# EAGLE design projeto_jcarlos(compacta) (EAGLE 6.2)
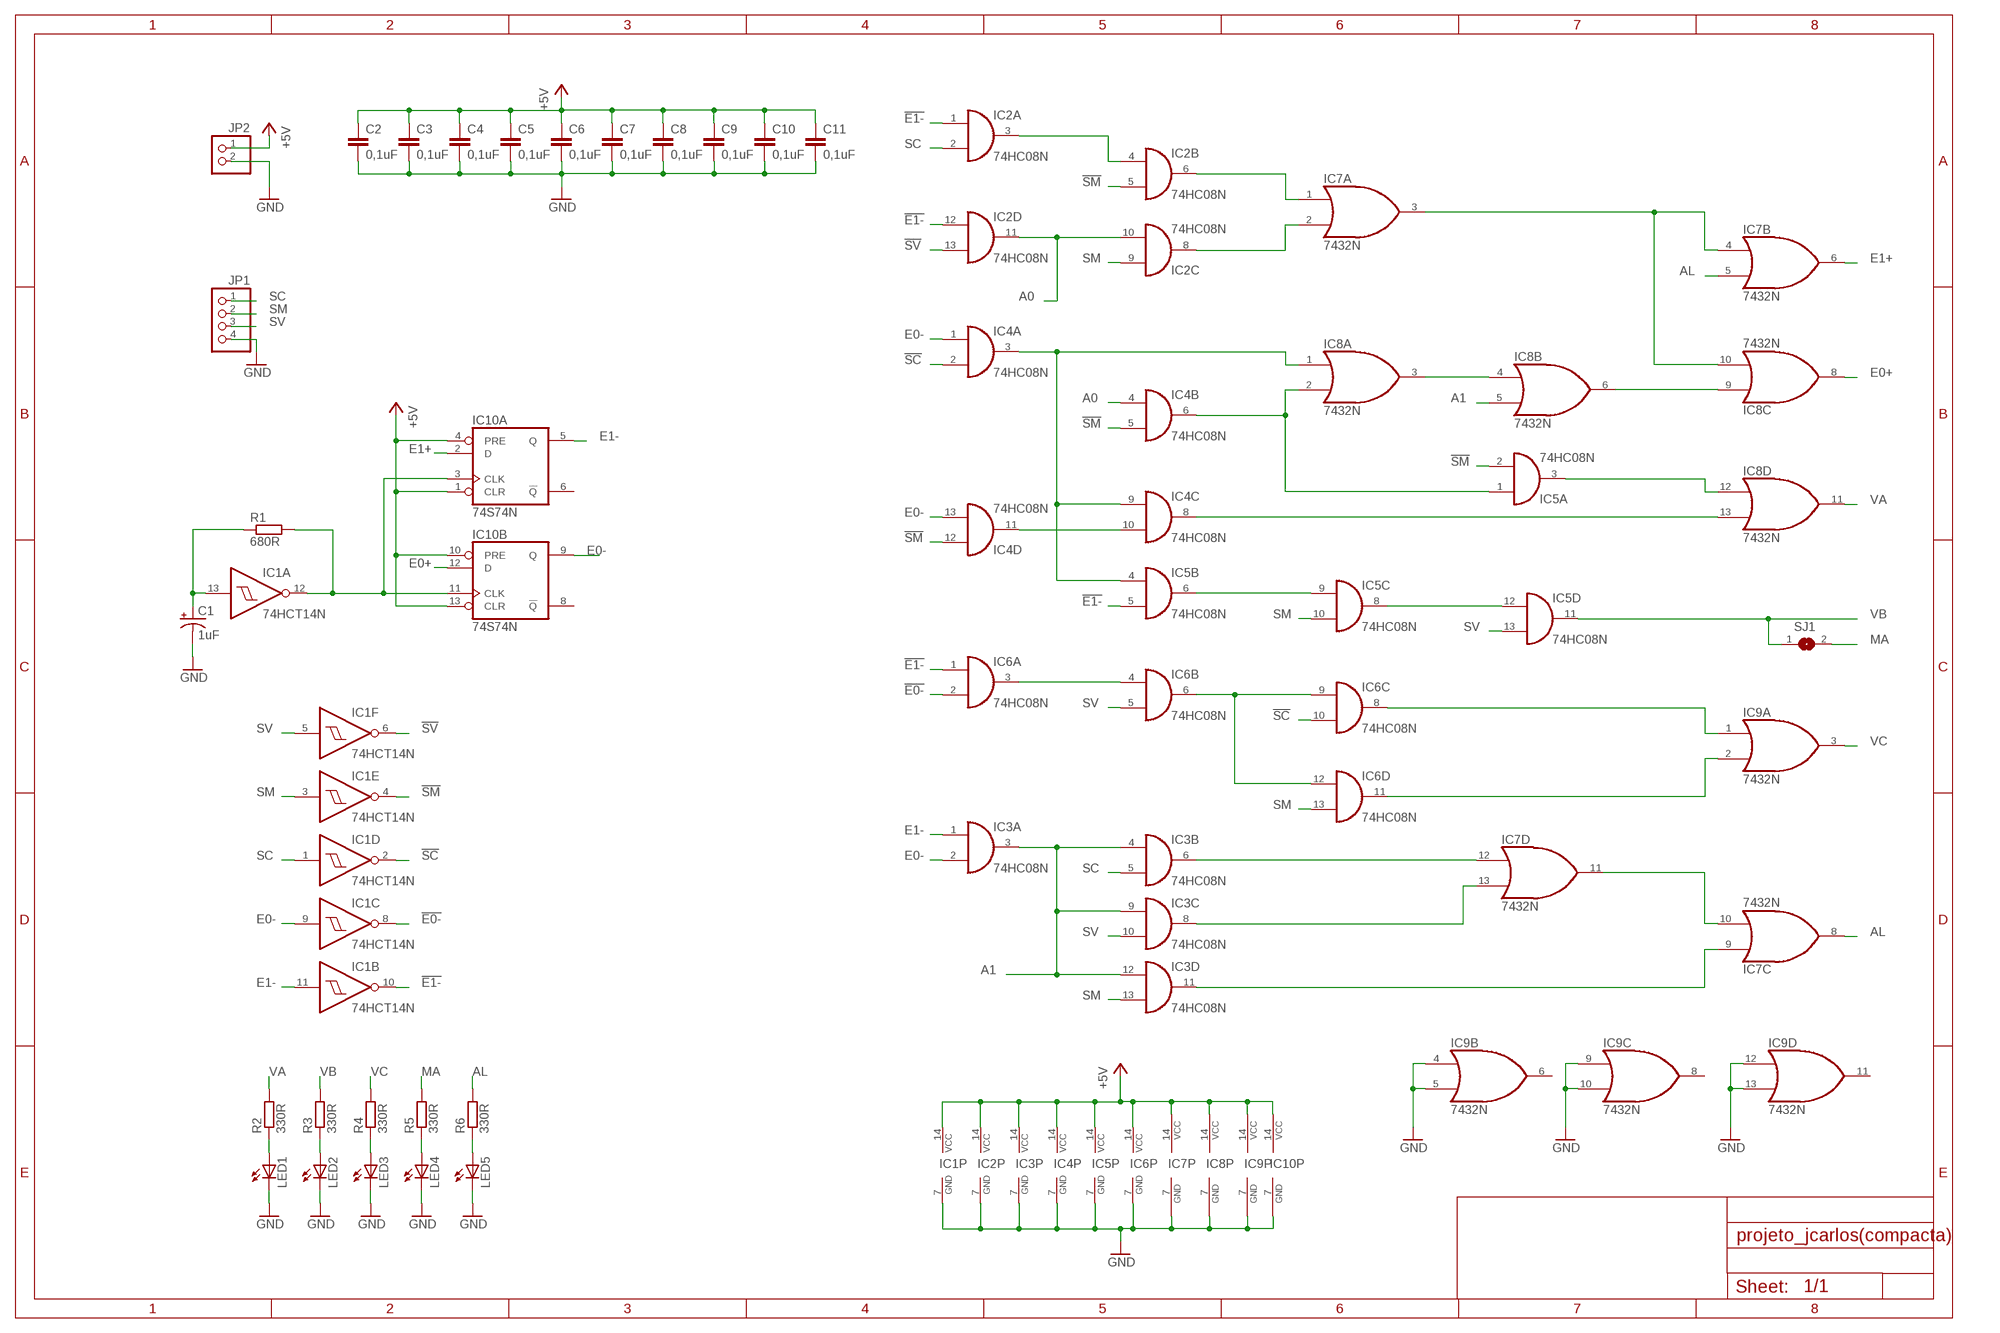
[diagram p0: schematic, sheet 1]

## Parts
C1  1uF  CPOL-USE5-6  [E5-6]
C2  0,1uF  C-EU025-025X050  [C025-025X050]
C3  0,1uF  C-EU025-025X050  [C025-025X050]
C4  0,1uF  C-EU025-025X050  [C025-025X050]
C5  0,1uF  C-EU025-025X050  [C025-025X050]
C6  0,1uF  C-EU025-025X050  [C025-025X050]
C7  0,1uF  C-EU025-025X050  [C025-025X050]
C8  0,1uF  C-EU025-025X050  [C025-025X050]
C9  0,1uF  C-EU025-025X050  [C025-025X050]
C10  0,1uF  C-EU025-025X050  [C025-025X050]
C11  0,1uF  C-EU025-025X050  [C025-025X050]
IC1  74HCT14N  [DIL14]
IC2  74HC08N  [DIL14]
IC3  74HC08N  [DIL14]
IC4  74HC08N  [DIL14]
IC5  74HC08N  [DIL14]
IC6  74HC08N  [DIL14]
IC7  7432N  [DIL14]
IC8  7432N  [DIL14]
IC9  7432N  [DIL14]
IC10  74S74N  [DIL14]
JP1  PINHD-1X4  [1X04]
JP2  PINHD-1X2  [1X02]
LED1  LED5MM  [LED5MM]
LED2  LED5MM  [LED5MM]
LED3  LED5MM  [LED5MM]
LED4  LED5MM  [LED5MM]
LED5  LED5MM  [LED5MM]
R1  680R  R-EU_0204/5  [0204/5]
R2  330R  R-EU_0204/5  [0204/5]
R3  330R  R-EU_0204/5  [0204/5]
R4  330R  R-EU_0204/5  [0204/5]
R5  330R  R-EU_0204/5  [0204/5]
R6  330R  R-EU_0204/5  [0204/5]
SJ1  SJ  [SJ]

## Nets
!E0-: IC1.8(C:O) IC6.2(A:I1)
!E1-: IC1.10(B:O) IC2.1(A:I0) IC2.12(D:I0) IC5.5(B:I1) IC6.1(A:I0)
!SC: IC1.2(D:O) IC4.2(A:I1) IC6.10(C:I1)
!SM: IC1.4(E:O) IC2.5(B:I1) IC4.5(B:I1) IC4.12(D:I0) IC5.2(A:I1)
!SV: IC1.6(F:O) IC2.13(D:I1)
+5V: C2.1 C3.1 C4.1 C5.1 C6.1 C7.1 C8.1 C9.1 C10.1 C11.1 IC1.14(P:VCC) IC2.14(P:VCC) IC3.14(P:VCC) IC4.14(P:VCC) IC5.14(P:VCC) IC6.14(P:VCC) IC7.14(P:VCC) IC8.14(P:VCC) IC9.14(P:VCC) IC10.1(A:CLR) IC10.4(A:PRE) IC10.10(B:PRE) IC10.13(B:CLR) IC10.14(P:VCC) JP2.1
A0: IC2.10(C:I1) IC2.11(D:O) IC4.4(B:I0)
A1: IC3.3(A:O) IC3.4(B:I0) IC3.9(C:I0) IC3.12(D:I0) IC8.5(B:I1)
AL: IC7.5(B:I1) IC7.8(C:O) R6.2
E0+: IC8.8(C:O) IC10.12(B:D)
E0-: IC1.9(C:I) IC3.2(A:I1) IC4.1(A:I0) IC4.13(D:I1) IC10.9(B:Q)
E1+: IC7.6(B:O) IC10.2(A:D)
E1-: IC1.11(B:I) IC3.1(A:I0) IC10.5(A:Q)
GND: C1.- C2.2 C3.2 C4.2 C5.2 C6.2 C7.2 C8.2 C9.2 C10.2 C11.2 IC1.7(P:GND) IC2.7(P:GND) IC3.7(P:GND) IC4.7(P:GND) IC5.7(P:GND) IC6.7(P:GND) IC7.7(P:GND) IC8.7(P:GND) IC9.4(B:I0) IC9.5(B:I1) IC9.7(P:GND) IC9.9(C:I0) IC9.10(C:I1) IC9.12(D:I0) IC9.13(D:I1) IC10.7(P:GND) JP1.4 JP2.2 LED1.K(C) LED2.K(C) LED3.K(C) LED4.K(C) LED5.K(C)
MA: R5.2 SJ1.2
N$1: IC5.6(B:O) IC5.9(C:I0)
N$2: IC7.3(A:O) IC7.4(B:I0) IC8.10(C:I1)
N$3: IC4.10(C:I1) IC4.11(D:O)
N$4: IC4.8(C:O) IC8.13(D:I1)
N$5: IC8.3(A:O) IC8.4(B:I0)
N$6: IC5.3(A:O) IC8.12(D:I0)
N$7: C1.+ IC1.13(A:I) R1.1
N$8: IC1.12(A:O) IC10.3(A:CLK) IC10.11(B:CLK) R1.2
N$9: IC8.6(B:O) IC8.9(C:I0)
N$10: IC4.3(A:O) IC4.9(C:I0) IC5.4(B:I0) IC8.1(A:I0)
N$11: IC5.8(C:O) IC5.12(D:I0)
N$12: IC4.6(B:O) IC5.1(A:I0) IC8.2(A:I1)
N$13: IC2.3(A:O) IC2.4(B:I0)
N$14: LED1.A R2.1
N$15: IC2.6(B:O) IC7.1(A:I0)
N$16: LED2.A R3.1
N$17: LED3.A R4.1
N$18: IC2.8(C:O) IC7.2(A:I1)
N$19: IC3.6(B:O) IC7.12(D:I0)
N$20: IC3.8(C:O) IC7.13(D:I1)
N$21: IC3.11(D:O) IC7.9(C:I0)
N$22: IC7.10(C:I1) IC7.11(D:O)
N$23: LED4.A R5.1
N$24: LED5.A R6.1
N$27: IC6.3(A:O) IC6.4(B:I0)
N$29: IC6.6(B:O) IC6.9(C:I0) IC6.12(D:I0)
N$32: IC6.8(C:O) IC9.1(A:I0)
N$33: IC6.11(D:O) IC9.2(A:I1)
SC: IC1.1(D:I) IC2.2(A:I1) IC3.5(B:I1) JP1.1
SM: IC1.3(E:I) IC2.9(C:I0) IC3.13(D:I1) IC5.10(C:I1) IC6.13(D:I1) JP1.2
SV: IC1.5(F:I) IC3.10(C:I1) IC5.13(D:I1) IC6.5(B:I1) JP1.3
VA: IC8.11(D:O) R2.2
VB: IC5.11(D:O) R3.2 SJ1.1
VC: IC9.3(A:O) R4.2
Unconnected: IC9.6(B:O) IC9.8(C:O) IC9.11(D:O) IC10.6(A:!Q) IC10.8(B:!Q)

## Library data of the parts
C1 = rcl:CPOL-US: POLARIZED CAPACITOR, American symbol; E5-6: E5-6
C2-C11 = rcl:C-EU: CAPACITOR, European symbol
IC1 = 74xx-eu:74*14: Hex schmitt trigger INVERTER
IC2-IC6 = 74xx-eu:74*08: Quad 2-input AND gate
IC7-IC9 = 74xx-us:74*32: Quad 2-input OR gate
IC10 = 74xx-us:74*74: Dual D type positive edge triggered FLIP FLOP, preset and clear
JP1 = pinhead:PINHD-1X4: PIN HEADER
JP2 = pinhead:PINHD-1X2: PIN HEADER
LED1-LED5 = led:LED: LED OSRAM: - CHIPLED LG R971, LG N971, LY N971, LG Q971, LY Q971, LO R971, LY R971 LH N974, LH R974 LS Q976, LO Q976, LY Q976 LO Q996 - Hyper CHIPLED LW Q18S LB Q993, LB Q99A, LB R99A - SideLED LS A670, LO A670, LY A670, LG A670, LP A670 LB A673, LV A673, LT A673, LW A673 LH A674 LY A675 LS A676, LA A676, LO A676, LY A676, LW A676 LS A679, LY A679, LG A679 - Hyper Micro SIDELED® LS Y876, LA Y876, LO Y876, LY Y876 LT Y87S - SmartLED LW L88C, LW L88S LB L89C, LB L89S, LG L890 LS L89K, LO L89K, LY L89K LS L896, LA L896, LO L896, LY L896 - TOPLED LS T670, LO T670, LY T670, LG T670, LP T670 LSG T670, LSP T670, LSY T670, LOP T670, LYG T670 LG T671, LOG T671, LSG T671 LB T673, LV T673, LT T673, LW T673 LH T674 LS T676, LA T676, LO T676, LY T676, LB T676, LH T676, LSB T676, LW T676 LB T67C, LV T67C, LT T67C, LS T67K, LO T67K, LY T67K, LW E67C LS E67B, LA E67B, LO E67B, LY E67B, LB E67C, LV E67C, LT E67C LW T67C LS T679, LY T679, LG T679 LS T770, LO T770, LY T770, LG T770, LP T770 LB T773, LV T773, LT T773, LW T773 LH T774 LS E675, LA E675, LY E675, LS T675 LS T776, LA T776, LO T776, LY T776, LB T776 LHGB T686 LT T68C, LB T68C - Hyper Mini TOPLED® LB M676 - Mini TOPLED Santana® LG M470 LS M47K, LO M47K, LY M47K Source: http://www.osram.convergy.de LUXEON: - LUMILED® LXK2-PW12-R00, LXK2-PW12-S00, LXK2-PW14-U00, LXK2-PW14-V00 LXK2-PM12-R00, LXK2-PM12-S00, LXK2-PM14-U00 LXK2-PE12-Q00, LXK2-PE12-R00, LXK2-PE12-S00, LXK2-PE14-T00, LXK2-PE14-U00 LXK2-PB12-K00, LXK2-PB12-L00, LXK2-PB12-M00, LXK2-PB14-N00, LXK2-PB14-P00, LXK2-PB14-Q00 LXK2-PR12-L00, LXK2-PR12-M00, LXK2-PR14-Q00, LXK2-PR14-R00 LXK2-PD12-Q00, LXK2-PD12-R00, LXK2-PD12-S00 LXK2-PH12-R00, LXK2-PH12-S00 LXK2-PL12-P00, LXK2-PL12-Q00, LXK2-PL12-R00 Source: www.luxeon.com KINGBRIGHT: KA-3528ASYC Source: www.kingbright.com
R1-R6 = rcl:R-EU_: RESISTOR, European symbol
SJ1 = jumper:SJ: SMD solder JUMPER

## Board
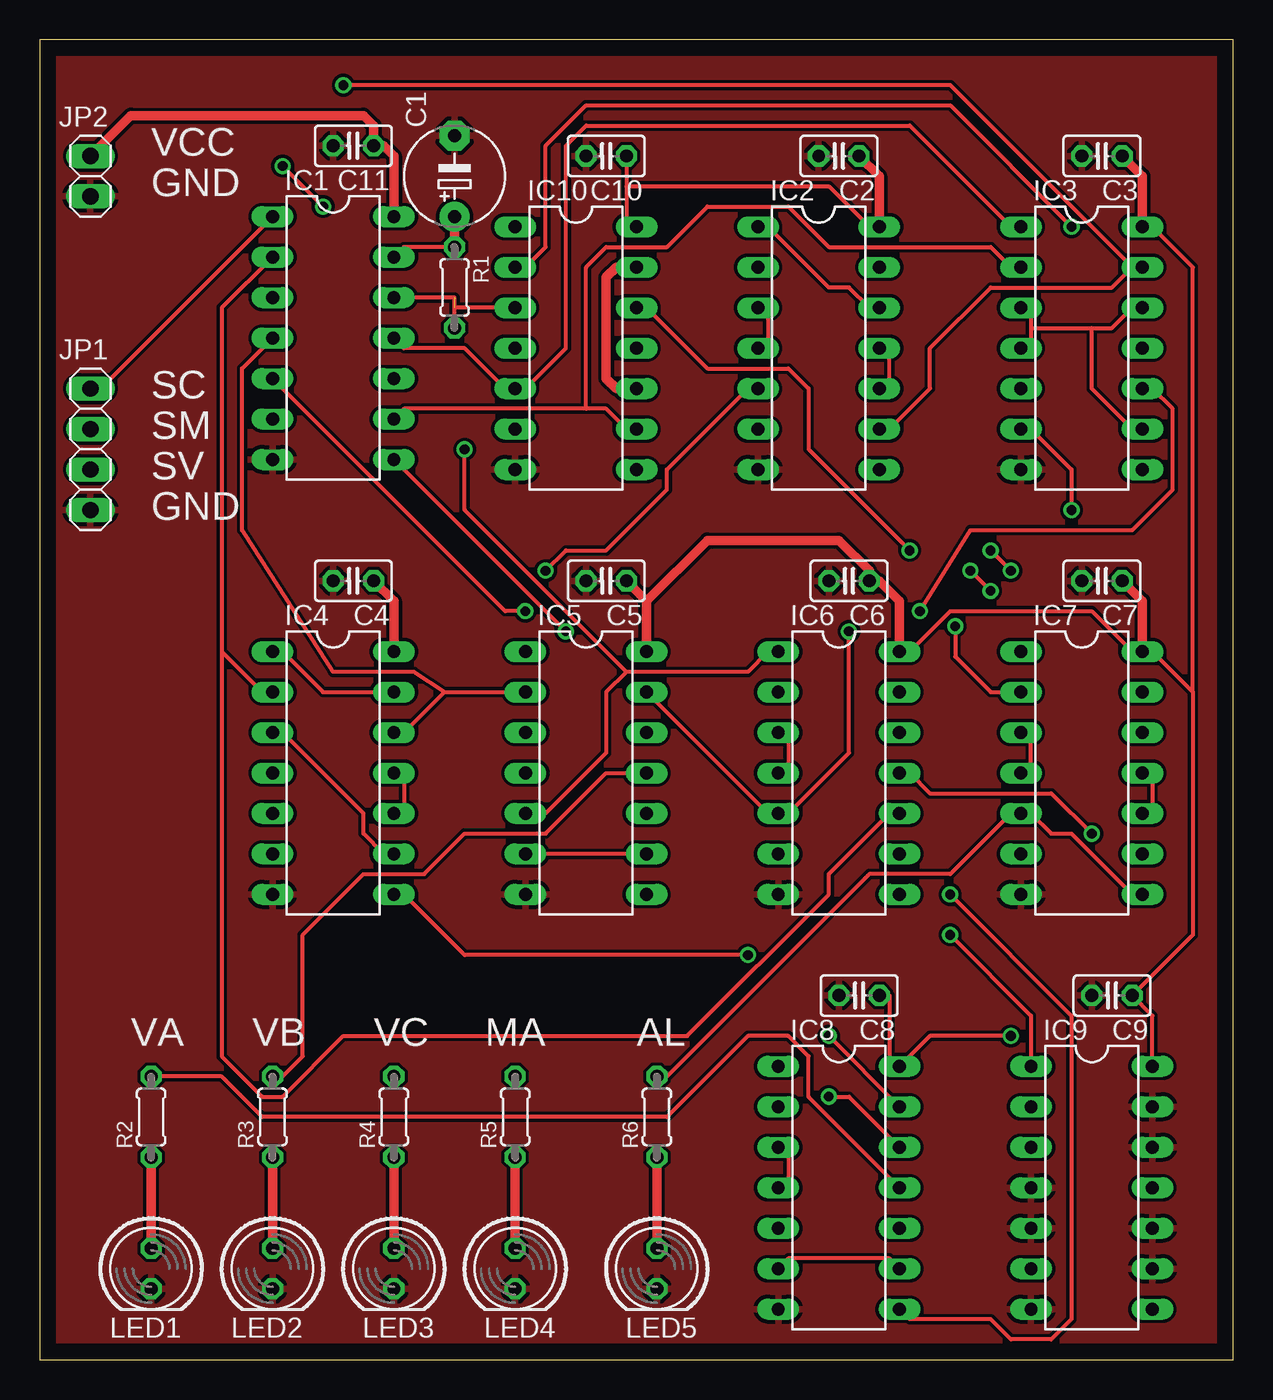
[diagram p1: board, top side]
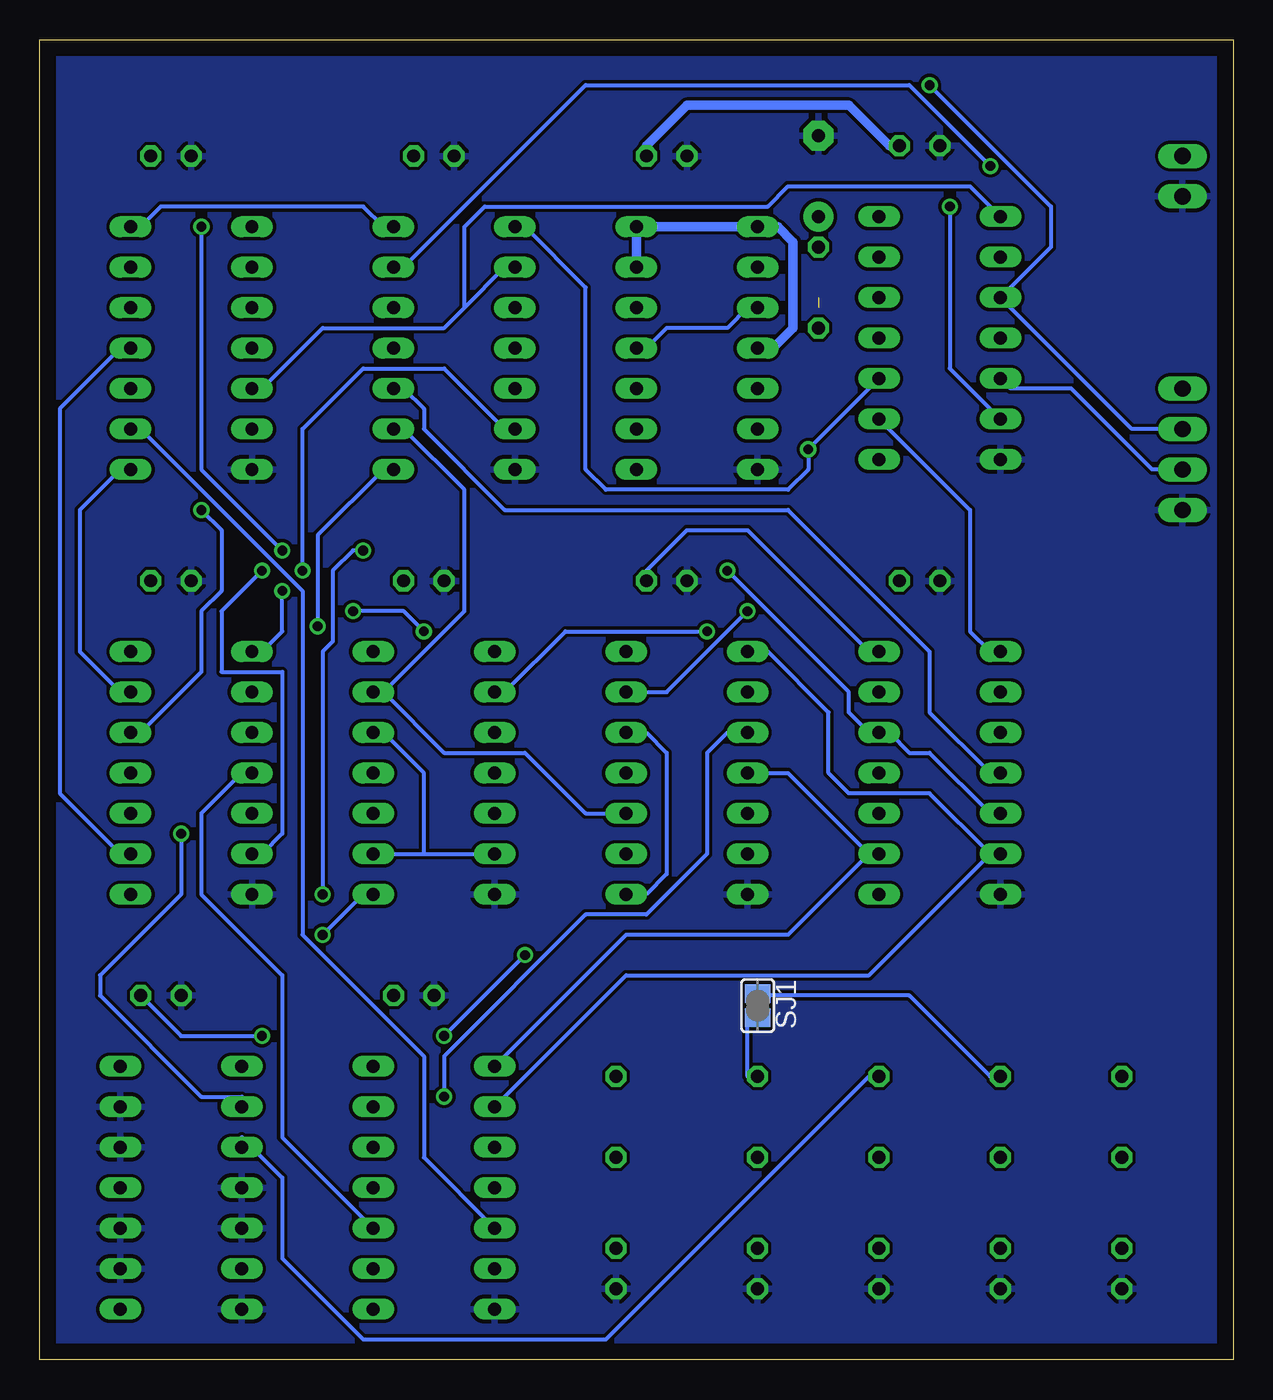
[diagram p2: board, bottom side, seen from below]

Size 74.91 x 82.86 mm. Coordinates in mm from the lower left corner, seen from the top.
Outline: 0,0 74.91,0 74.91,82.86 0,82.86 0,0
Copper layers (1*16): Top 0.035mm / dielectric 1.5mm / Bottom 0.035mm
Design rules: minimum track width 10mil, minimum drill 24mil, track to track 8mil, track to pad 8mil, pad to pad 8mil, via to via 8mil, smd to smd 8mil, copper to edge 40mil, drill to drill 8mil, minimum pad ring 10mil, minimum via ring 8mil, stop-mask expansion 4mil, vias tented up to drill 0mil, thermal gap 10mil

### Footprints (pad centres in the part's own frame; a part is rotated, then mirrored left to right if it is on the bottom)
E5-6 = drill 0.813 pad 1.905: + -2.54,0 | drill 0.813 pad 1.905 octagon: - 2.54,0
C025-025X050 = drill 0.813 octagon: 1 -1.27,0; 2 1.27,0
DIL14 = drill 0.813 long: 1 -7.62,-3.81; 2 -5.08,-3.81; 3 -2.54,-3.81; 4 0,-3.81; 5 2.54,-3.81; 6 5.08,-3.81; 7 7.62,-3.81; 8 7.62,3.81; 9 5.08,3.81; 10 2.54,3.81; 11 0,3.81; 12 -2.54,3.81; 13 -5.08,3.81; 14 -7.62,3.81
1X04 = drill 1.016 long: 1 -3.81,0; 2 -1.27,0; 3 1.27,0; 4 3.81,0
1X02 = drill 1.016 long: 1 -1.27,0; 2 1.27,0
LED5MM = drill 0.813 octagon: A -1.27,0; K 1.27,0
0204/5 = drill 0.813 octagon: 1 -2.54,0; 2 2.54,0
SJ = smd 1.168 x 1.6: 1 -0.762,0; 2 0.762,0

### Placement (x,y rotation side)
C1  26.04,74.3 90 top
C2  50.16,75.56 180 top
C3  66.67,75.56 180 top
C4  19.68,48.9 180 top
C5  35.56,48.9 180 top
C6  50.8,48.9 180 top
C7  66.67,48.9 180 top
C8  51.44,22.86 180 top
C9  67.31,22.86 180 top
C10  35.56,75.56 180 top
C11  19.68,76.2 180 top
IC1  18.41,64.14 270 top
IC2  48.9,63.5 270 top
IC3  65.41,63.5 270 top
IC4  18.41,36.83 270 top
IC5  34.29,36.83 270 top
IC6  50.16,36.83 270 top
IC7  65.41,36.83 270 top
IC8  50.16,10.79 270 top
IC9  66.04,10.79 270 top
IC10  33.66,63.5 270 top
JP1  3.17,57.15 270 top
JP2  3.17,74.3 270 top
LED1  6.99,5.71 270 top
LED2  14.61,5.71 270 top
LED3  22.23,5.71 270 top
LED4  29.84,5.71 270 top
LED5  38.73,5.71 270 top
R1  26.04,67.31 270 top
R2  6.99,15.24 90 top
R3  14.61,15.24 90 top
R4  22.23,15.24 90 top
R5  29.84,15.24 90 top
R6  38.73,15.24 90 top
SJ1  29.84,22.23 270 bottom

### Tracks (layer width: path | path; a pad name or v marks a point on that pad's centre or on a via)
!E0-  (via drill 0.61)
  Top 0.254: v33.02,45.72 IC1.8
  Bottom 0.254: v33.02,45.72 41.91,45.72 45.72,41.91 IC6.2
!E1-  (via drill 0.61)
  Top 0.254: IC2.1 45.72,71.12 49.53,67.31 50.8,67.31 52.07,66.04 IC2.12 | IC5.5 31.75,34.29 35.56,38.1 35.56,41.91 36.83,43.18 | 36.83,43.18 44.45,43.18 45.72,44.45 IC6.1 | v26.67,57.15 26.67,53.34 36.83,43.18
  Bottom 0.254: IC1.10 v26.67,57.15 26.67,55.88 27.94,54.61 39.37,54.61 40.64,55.88 40.64,67.31 44.45,71.12 IC2.1
!SC
  Top 0.254: 11.43,44.45 13.97,41.91 IC4.2 | 11.43,44.45 11.43,66.04 IC1.2 | 11.43,44.45 11.43,19.05 13.97,16.51 15.24,16.51 19.05,20.32 40.64,20.32 49.53,29.21 49.53,30.48 53.34,34.29 IC6.10
!SM  (via drill 0.61)
  Top 0.254: 25.4,41.91 IC5.2 | 25.4,41.91 22.86,39.37 IC4.12 | IC1.4 12.7,62.23 12.7,52.07 18.41,43.18 23.5,43.18 25.4,41.91 | v31.75,49.53 33.02,50.8 35.56,50.8 39.37,54.61 39.37,55.88 44.45,60.96 IC2.5
  Bottom 0.254: IC4.5 15.24,34.29 19.05,38.1 20.32,38.1 21.59,39.37 IC4.12 22.86,39.37 24.13,40.64 24.13,41.91 v31.75,49.53
!SV  (via drill 0.61)
  Top 0.254: v15.24,74.93 v17.78,72.39
  Bottom 0.254: IC1.6 17.78,62.23 v17.78,72.39 | v15.24,74.93 20.32,80.01 40.64,80.01 52.07,68.58 IC2.13
+5V  (via drill 0.61)
  Top 0.254: C10.1 36.83,73.66 | 36.83,73.66 36.83,71.12 IC10.14 | 36.83,73.66 49.53,73.66 52.07,71.12 IC2.14 | C8.1 53.34,22.86 53.34,19.05 IC8.14 55.88,20.32 v60.96,20.32 | IC9.14 69.85,21.59 C9.1 72.39,26.67 72.39,41.91 | IC6.14 54.61,44.45 57.15,46.99 66.04,46.99 68.58,44.45 IC7.14 69.85,44.45 72.39,41.91 | 72.39,41.91 72.39,68.58 69.85,71.12 IC3.14
  Top 0.61: C4.1 22.23,47.62 IC4.14 | C7.1 69.22,47.62 IC7.14 | C3.1 69.22,74.3 IC3.14 | C2.1 52.7,74.3 IC2.14 | JP2.1 5.71,78.11 20.32,78.11 20.95,77.47 C11.1 21.59,76.2 22.23,75.56 IC1.14 | IC6.14 53.98,47.62 52.7,48.9 C6.1 52.07,49.53 50.16,51.44 41.91,51.44 38.1,47.62 | C5.1 38.1,47.62 | IC5.14 38.1,47.62 | IC10.13 36.2,68.58 35.56,67.94 35.56,61.59 36.2,60.96 IC10.10
  Bottom 0.254: IC3.14 68.58,71.12 67.31,72.39 54.61,72.39 53.34,71.12 IC2.14 | v60.96,20.32 66.04,20.32 C9.1 | IC4.14 22.86,44.45 30.48,52.07 34.29,52.07 36.83,49.53 C5.1
  Bottom 0.61: C11.1 21.59,76.2 24.13,78.74 34.29,78.74 36.83,76.2 C10.1 | IC10.13 IC10.14 IC10.1 28.57,71.12 27.62,70.17 27.62,64.77 28.89,63.5 IC10.4
A0
  Top 0.254: IC2.11 53.34,63.5 53.34,60.96 IC2.10
  Bottom 0.254: IC4.4 15.24,36.83 19.05,40.64 19.05,44.45 27.94,53.34 45.72,53.34 50.8,58.42 50.8,59.69 52.07,60.96 IC2.10
A1
  Top 0.254: 62.23,64.77 62.23,66.04 IC3.3 | 62.23,64.77 62.23,63.5 IC3.4 | 62.23,64.77 66.04,64.77 | 66.04,64.77 67.31,64.77 68.58,66.04 IC3.12 | 66.04,64.77 66.04,60.96 68.58,58.42 IC3.9
  Bottom 0.254: IC8.5 50.8,12.7 50.8,19.05 58.42,26.67 58.42,48.26 68.58,58.42 IC3.9
AL
  Top 0.254: R6.2 39.37,17.78 52.07,30.48 57.15,30.48 60.96,34.29 IC7.5 62.23,34.29 63.5,33.02 64.77,33.02 68.58,29.21 IC7.8
E0+  (via drill 0.61)
  Top 0.254: v57.15,29.21 64.77,21.59 64.77,2.54 63.5,1.27 60.96,1.27 59.69,2.54 54.61,2.54 IC8.8 | v54.61,50.8 48.26,57.15 48.26,60.96 46.99,62.23 41.91,62.23 38.1,66.04 IC10.12
  Bottom 0.254: v57.15,29.21 57.15,44.45 56.52,45.09 56.52,49.53 55.24,50.8 v54.61,50.8
E0-
  Top 0.254: IC4.1 15.24,44.45 17.78,41.91 IC4.13 | 34.29,59.69 35.56,59.69 36.83,58.42 IC10.9 | 34.29,59.69 22.86,59.69 IC1.9 | 34.29,59.69 34.29,68.58 35.56,69.85 39.37,69.85 41.91,72.39 46.99,72.39 49.53,69.85 59.69,69.85 60.96,68.58 IC3.2
  Bottom 0.254: IC1.9 16.51,53.34 16.51,45.72 15.24,44.45 IC4.1
E1+  (via drill 0.61)
  Top 0.254: v59.69,50.8 v60.96,49.53 | v64.77,71.12 57.15,78.74 34.29,78.74 31.75,76.2 31.75,69.85 30.48,68.58 IC10.2
  Bottom 0.254: v60.96,49.53 63.5,46.99 63.5,43.18 59.69,43.18 59.69,33.02 60.96,31.75 IC7.6 | v59.69,50.8 64.77,55.88 v64.77,71.12
E1-
  Top 0.254: IC1.11 22.86,63.5 26.67,63.5 29.21,60.96 IC10.5 30.48,60.96 33.02,63.5 33.02,76.2 34.29,77.47 54.61,77.47 60.96,71.12 IC3.1
GND
  pour Bottom: -1.91,83.82 76.83,83.82 77.47,-1.27 -1.27,-1.27
  pour Top: -1.27,83.82 76.83,83.82 76.83,-1.27 -1.27,-1.27
MA
  Bottom 0.254: SJ1.2 30.48,21.59 30.48,17.78 R5.2
N$1
  Top 0.254: IC5.9 IC5.6
N$2
  Top 0.254: IC7.3 62.23,39.37 62.23,36.83 IC7.4
  Bottom 0.254: IC8.10 59.69,13.97 59.69,24.13 64.77,29.21 64.77,34.29 62.23,36.83 IC7.4
N$3
  Top 0.254: IC4.10 22.86,34.29 22.86,36.83 IC4.11
N$4  (via drill 0.61)
  Top 0.254: v44.45,25.4 26.67,25.4 22.86,29.21 IC4.8 | IC8.13 v49.53,20.32
  Bottom 0.254: v49.53,20.32 v44.45,25.4
N$5
  Top 0.254: IC8.4 46.99,11.43 46.99,12.7 IC8.3
N$6  (via drill 0.61)
  Top 0.254: IC8.12 50.8,16.51 v49.53,16.51
  Bottom 0.254: v49.53,16.51 49.53,19.05 40.64,27.94 36.83,27.94 33.02,31.75 33.02,38.1 31.75,39.37 IC5.3
N$7
  Top 0.254: R1.1 22.86,69.85 IC1.13
  Top 0.61: R1.1 C1.+
N$8  (1 unrouted)
  Top 0.254: IC10.3 26.04,66.04 | R1.2 26.04,66.67 IC1.12
  Bottom 0.254: IC10.11 36.83,63.5 35.56,64.77 31.75,64.77 30.48,66.04 IC10.3
N$9
  Top 0.254: IC8.6 46.99,6.35 53.34,6.35 IC8.9
N$10
  Top 0.254: IC4.3 15.24,39.37 20.32,34.29 20.32,33.02 21.59,31.75 IC4.9
  Bottom 0.254: 22.86,31.75 27.94,36.83 IC5.4 | IC8.1 38.1,26.67 27.94,26.67 22.86,31.75 | 22.86,31.75 IC4.9
N$11
  Bottom 0.254: IC5.8 36.83,29.21 35.56,30.48 35.56,38.1 36.83,39.37 IC5.12
N$12
  Bottom 0.254: 15.24,31.75 22.86,24.13 38.1,24.13 IC8.2 | IC5.1 29.21,44.45 25.4,40.64 25.4,36.83 24.13,35.56 19.05,35.56 15.24,31.75 | 15.24,31.75 IC4.6
N$13
  Top 0.254: IC2.4 45.72,63.5 45.72,66.04 IC2.3
N$14
  Top 0.61: LED1.A R2.1
N$15  (via drill 0.61)
  Top 0.254: v59.69,48.26 v58.42,49.53
  Bottom 0.254: v58.42,49.53 58.42,58.42 54.61,62.23 49.53,62.23 45.72,58.42 IC2.6 | v59.69,48.26 59.69,45.72 60.96,44.45 IC7.1
N$16
  Top 0.61: LED2.A R3.1
N$17
  Top 0.61: LED3.A R4.1
N$18  (via drill 0.61)
  Top 0.254: v57.47,46.04 57.47,44.13 59.69,41.91 IC7.2
  Bottom 0.254: v57.47,46.04 57.47,51.75 53.34,55.88 IC2.8
N$19  (via drill 0.61)
  Top 0.254: v64.77,53.34 64.77,55.88 62.23,58.42 IC3.6
  Bottom 0.254: v64.77,53.34 63.5,52.07 63.5,48.26 64.77,46.99 64.77,43.18 68.58,39.37 IC7.12
N$20
  Bottom 0.254: IC7.13 69.85,41.91 72.39,44.45 72.39,53.34 69.85,55.88 IC3.8
N$21
  Bottom 0.254: IC7.9 69.85,31.75 73.66,35.56 73.66,59.69 69.85,63.5 IC3.11
N$22
  Top 0.254: IC7.10 69.85,34.29 69.85,36.83 IC7.11
N$23
  Top 0.61: LED4.A R5.1
N$24
  Top 0.61: LED5.A R6.1
N$27
  Top 0.254: IC6.4 46.99,36.83 46.99,39.37 IC6.3
N$29
  Bottom 0.254: IC6.9 50.8,31.75 | 50.8,31.75 IC6.6 | 50.8,31.75 50.8,36.83 53.34,39.37 IC6.12
N$32  (via drill 0.61)
  Top 0.254: IC9.1 62.23,21.59 v57.15,26.67
  Bottom 0.254: v57.15,26.67 54.61,29.21 IC6.8
N$33  (via drill 0.61)
  Top 0.254: v66.04,33.02 63.5,35.56 55.88,35.56 54.61,36.83 IC6.11
  Bottom 0.254: v66.04,33.02 66.04,29.21 71.12,24.13 71.12,22.86 64.77,16.51 62.23,16.51 IC9.2
SC
  Top 0.254: IC1.1 3.81,60.96 JP1.1
  Bottom 0.254: 48.26,66.04 49.53,64.77 57.15,64.77 60.96,60.96 IC3.5 | 48.26,66.04 45.72,68.58 IC2.2 | IC1.1 16.51,73.66 27.94,73.66 29.21,72.39 46.99,72.39 48.26,71.12 48.26,66.04
SM  (via drill 0.61)
  Top 0.254: 68.58,68.58 67.31,67.31 59.69,67.31 55.88,63.5 55.88,60.96 53.34,58.42 IC2.9 | v19.05,80.01 57.15,80.01 68.58,68.58 | 68.58,68.58 IC3.13
  Bottom 0.254: JP1.2 6.35,58.42 IC1.3 11.43,69.85 11.43,72.39 v19.05,80.01 | IC5.10 40.64,34.29 44.45,38.1 49.53,38.1 53.34,41.91 | 53.34,41.91 48.26,46.99 48.26,54.61 52.07,58.42 IC2.9 | 53.34,41.91 IC6.13
SV  (via drill 0.61)
  Top 0.254: IC5.13 45.72,34.29 IC6.5 46.99,34.29 50.8,38.1 v50.8,45.72 | v55.24,46.99 58.42,52.07 68.58,52.07 71.12,54.61 71.12,59.69 69.85,60.96 IC3.10 | IC1.5 29.21,46.99 v30.48,46.99
  Bottom 0.254: JP1.3 5.08,55.88 10.16,60.96 13.97,60.96 IC1.5 | v55.24,46.99 52.07,46.99 v50.8,45.72 | v30.48,46.99 35.56,41.91 IC5.13
VA
  Top 0.254: R2.2 11.43,17.78 13.97,15.24 39.37,15.24 44.45,20.32 46.99,20.32 48.26,19.05 48.26,16.51 IC8.11
VB
  Top 0.254: IC5.11 35.56,36.83 31.75,33.02 26.67,33.02 24.13,30.48 20.32,30.48 16.51,26.67 16.51,19.05 15.24,17.78 R3.2
  Bottom 0.254: SJ1.1 29.21,22.86 20.32,22.86 15.24,17.78 R3.2
VC
  Bottom 0.254: R4.2 22.86,17.78 39.37,1.27 54.61,1.27 59.69,6.35 59.69,11.43 62.23,13.97 IC9.3

### Text on the board
tNames: VCC | GND | SC | SM | SV | GND | VA | VB | VC | MA | AL